# EasyEDA schematic 1-Schematic_SuperCharger_v1.json
TITLE: Sheet_1; REV: 1.0; Date: 2020-12-08; Sheet: 1/1; Drawn By: Josselin Somerville Roberts; Company: Your Company
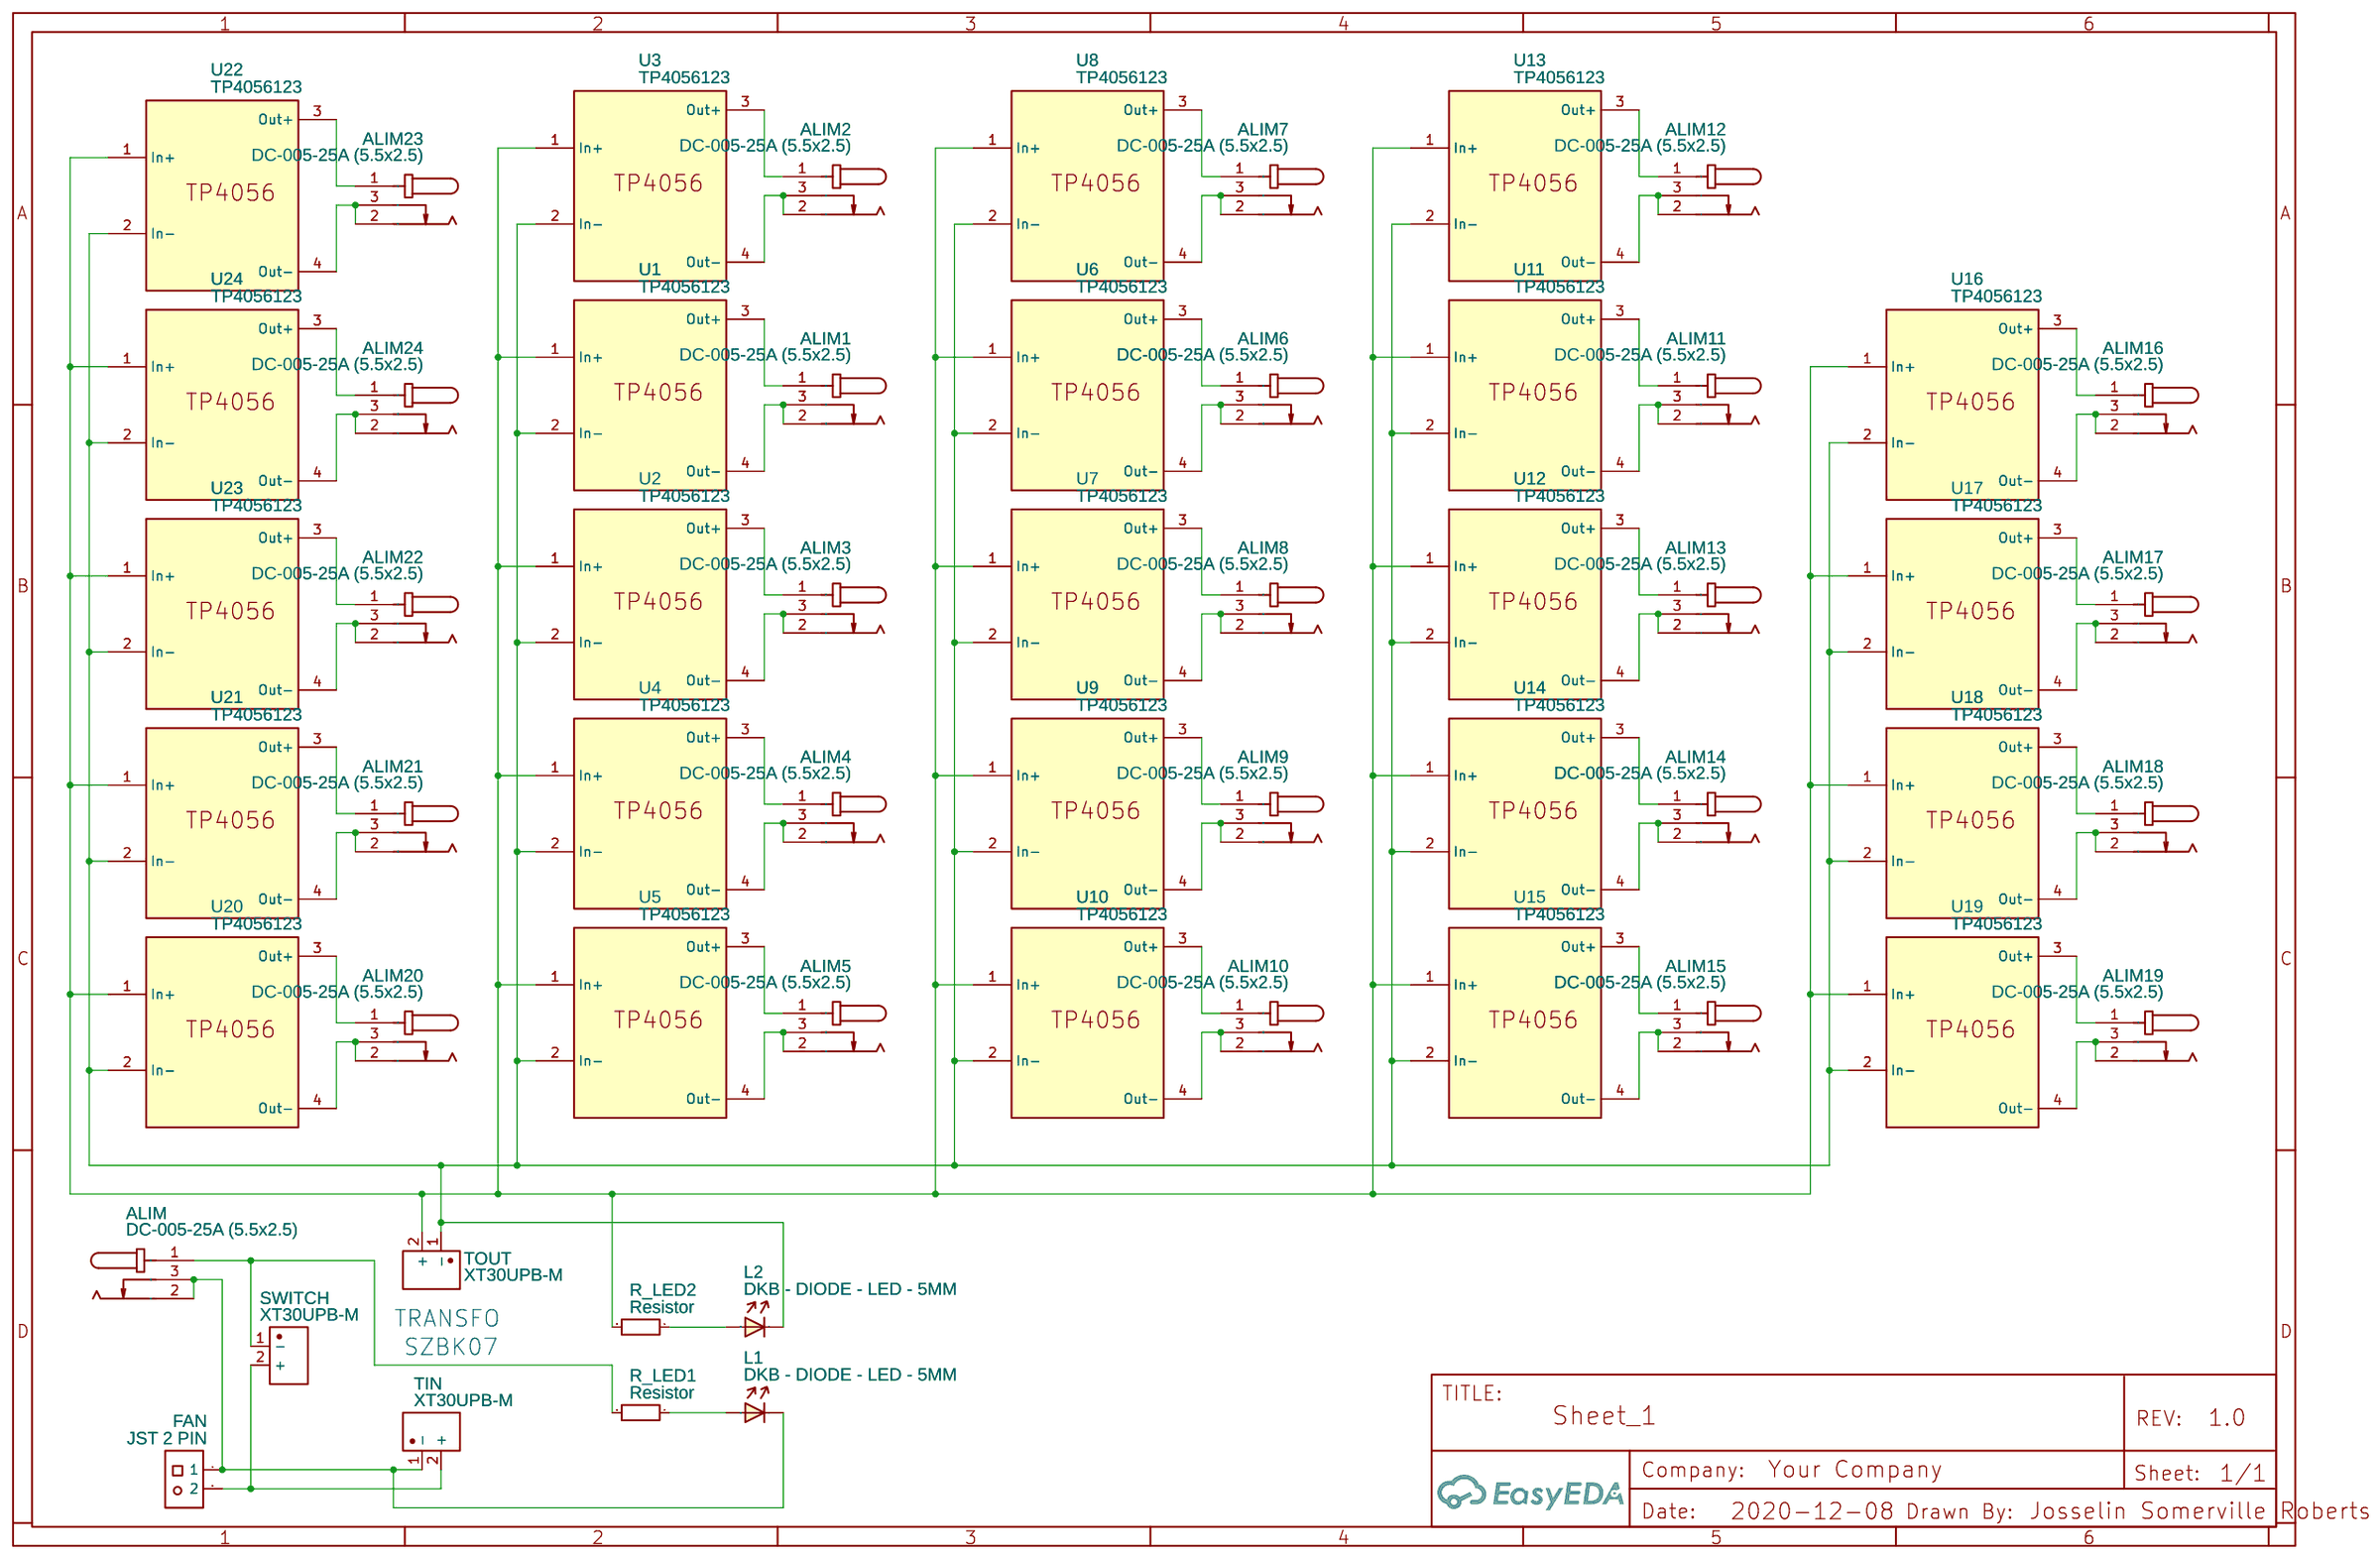
[diagram p0: schematic sheet]

## Parts
ALIM  DC-005-25A (5.5x2.5)  [DC-005-25A]
ALIM1  DC-005-25A (5.5x2.5)  [DC-005-25A]
ALIM2  DC-005-25A (5.5x2.5)  [DC-005-25A]
ALIM3  DC-005-25A (5.5x2.5)  [DC-005-25A]
ALIM4  DC-005-25A (5.5x2.5)  [DC-005-25A]
ALIM5  DC-005-25A (5.5x2.5)  [DC-005-25A]
ALIM6  DC-005-25A (5.5x2.5)  [DC-005-25A]
ALIM7  DC-005-25A (5.5x2.5)  [DC-005-25A]
ALIM8  DC-005-25A (5.5x2.5)  [DC-005-25A]
ALIM9  DC-005-25A (5.5x2.5)  [DC-005-25A]
ALIM10  DC-005-25A (5.5x2.5)  [DC-005-25A]
ALIM11  DC-005-25A (5.5x2.5)  [DC-005-25A]
ALIM12  DC-005-25A (5.5x2.5)  [DC-005-25A]
ALIM13  DC-005-25A (5.5x2.5)  [DC-005-25A]
ALIM14  DC-005-25A (5.5x2.5)  [DC-005-25A]
ALIM15  DC-005-25A (5.5x2.5)  [DC-005-25A]
ALIM16  DC-005-25A (5.5x2.5)  [DC-005-25A]
ALIM17  DC-005-25A (5.5x2.5)  [DC-005-25A]
ALIM18  DC-005-25A (5.5x2.5)  [DC-005-25A]
ALIM19  DC-005-25A (5.5x2.5)  [DC-005-25A]
ALIM20  DC-005-25A (5.5x2.5)  [DC-005-25A]
ALIM21  DC-005-25A (5.5x2.5)  [DC-005-25A]
ALIM22  DC-005-25A (5.5x2.5)  [DC-005-25A]
ALIM23  DC-005-25A (5.5x2.5)  [DC-005-25A]
ALIM24  DC-005-25A (5.5x2.5)  [DC-005-25A]
FAN  JST 2 PIN  [JST_2-PIN_2.54MM]
L1  DKB - DIODE - LED - 5MM  [5MM LED]
L2  DKB - DIODE - LED - 5MM  [5MM LED]
R_LED1  Resistor  [RESISTOR]
R_LED2  Resistor  [RESISTOR]
SWITCH  XT30UPB-M  [CONN-TH_XT30UPB-M]
TIN  XT30UPB-M  [CONN-TH_XT30UPB-M]
TOUT  XT30UPB-M  [CONN-TH_XT30UPB-M]
U1  TP4056123  [TP4056SAM]
U2  TP4056123  [TP4056SAM]
U3  TP4056123  [TP4056SAM]
U4  TP4056123  [TP4056SAM]
U5  TP4056123  [TP4056SAM]
U6  TP4056123  [TP4056SAM]
U7  TP4056123  [TP4056SAM]
U8  TP4056123  [TP4056SAM]
U9  TP4056123  [TP4056SAM]
U10  TP4056123  [TP4056SAM]
U11  TP4056123  [TP4056SAM]
U12  TP4056123  [TP4056SAM]
U13  TP4056123  [TP4056SAM]
U14  TP4056123  [TP4056SAM]
U15  TP4056123  [TP4056SAM]
U16  TP4056123  [TP4056SAM]
U17  TP4056123  [TP4056SAM]
U18  TP4056123  [TP4056SAM]
U19  TP4056123  [TP4056SAM]
U20  TP4056123  [TP4056SAM]
U21  TP4056123  [TP4056SAM]
U22  TP4056123  [TP4056SAM]
U23  TP4056123  [TP4056SAM]
U24  TP4056123  [TP4056SAM]

## Library data of the parts
ALIM ALIM1-ALIM24 = DC-005-25A (5.5x2.5): Supplier: LCSC; Manufacturer: HRO; Contributor: LCSC; Supplier Part: C136715
FAN = JST 2 PIN: Manufacturer Part: JST_XH CONNECTOR; link: https://nl.aliexpress.com/item/50-sets-Kit-in-doos-2-p-3-p-4-pin-2-54mm-Pitch-Terminal-Behuizing/32681086028.html?spm=a2g0s.9042311.0.0.I0g15Z; Contributor: CowboyWillT
L1 L2 = DKB - DIODE - LED - 5MM: Manufacturer Part: 5mm LED; Contributor: Axbri
R_LED1 R_LED2 = Resistor: Contributor: ChaseWyattt
SWITCH TIN TOUT = XT30UPB-M: Supplier: LCSC; Supplier Part: C428721; Manufacturer: Changzhou Amass Elec; Contributor: LCSC
U1-U24 = TP4056123: Contributor: Василий Пупкин

## Nets
Net-(ALIM1-1): ALIM1.1 U1.3(Out+)
Net-(ALIM1-2): ALIM1.2 ALIM1.3 U1.4(Out-)
Net-(ALIM2-1): ALIM2.1 U3.3(Out+)
Net-(ALIM2-2): ALIM2.2 ALIM2.3 U3.4(Out-)
Net-(ALIM3-1): ALIM3.1 U2.3(Out+)
Net-(ALIM3-2): ALIM3.2 ALIM3.3 U2.4(Out-)
Net-(ALIM4-1): ALIM4.1 U4.3(Out+)
Net-(ALIM4-2): ALIM4.2 ALIM4.3 U4.4(Out-)
Net-(ALIM5-1): ALIM5.1 U5.3(Out+)
Net-(ALIM5-2): ALIM5.2 ALIM5.3 U5.4(Out-)
Net-(ALIM6-1): ALIM6.1 U6.3(Out+)
Net-(ALIM6-2): ALIM6.2 ALIM6.3 U6.4(Out-)
Net-(ALIM7-1): ALIM7.1 U8.3(Out+)
Net-(ALIM7-2): ALIM7.2 ALIM7.3 U8.4(Out-)
Net-(ALIM8-1): ALIM8.1 U7.3(Out+)
Net-(ALIM8-2): ALIM8.2 ALIM8.3 U7.4(Out-)
Net-(ALIM9-1): ALIM9.1 U9.3(Out+)
Net-(ALIM9-2): ALIM9.2 ALIM9.3 U9.4(Out-)
Net-(ALIM10-1): ALIM10.1 U10.3(Out+)
Net-(ALIM10-2): ALIM10.2 ALIM10.3 U10.4(Out-)
Net-(ALIM11-1): ALIM11.1 U11.3(Out+)
Net-(ALIM11-2): ALIM11.2 ALIM11.3 U11.4(Out-)
Net-(ALIM12-1): ALIM12.1 U13.3(Out+)
Net-(ALIM12-2): ALIM12.2 ALIM12.3 U13.4(Out-)
Net-(ALIM13-1): ALIM13.1 U12.3(Out+)
Net-(ALIM13-2): ALIM13.2 ALIM13.3 U12.4(Out-)
Net-(ALIM14-1): ALIM14.1 U14.3(Out+)
Net-(ALIM14-2): ALIM14.2 ALIM14.3 U14.4(Out-)
Net-(ALIM15-1): ALIM15.1 U15.3(Out+)
Net-(ALIM15-2): ALIM15.2 ALIM15.3 U15.4(Out-)
Net-(ALIM16-1): ALIM16.1 U16.3(Out+)
Net-(ALIM16-2): ALIM16.2 ALIM16.3 U16.4(Out-)
Net-(ALIM17-1): ALIM17.1 U17.3(Out+)
Net-(ALIM17-2): ALIM17.2 ALIM17.3 U17.4(Out-)
Net-(ALIM18-1): ALIM18.1 U18.3(Out+)
Net-(ALIM18-2): ALIM18.2 ALIM18.3 U18.4(Out-)
Net-(ALIM19-1): ALIM19.1 U19.3(Out+)
Net-(ALIM19-2): ALIM19.2 ALIM19.3 U19.4(Out-)
Net-(ALIM20-1): ALIM20.1 U20.3(Out+)
Net-(ALIM20-2): ALIM20.2 ALIM20.3 U20.4(Out-)
Net-(ALIM21-1): ALIM21.1 U21.3(Out+)
Net-(ALIM21-2): ALIM21.2 ALIM21.3 U21.4(Out-)
Net-(ALIM22-1): ALIM22.1 U23.3(Out+)
Net-(ALIM22-2): ALIM22.2 ALIM22.3 U23.4(Out-)
Net-(ALIM23-1): ALIM23.1 U22.3(Out+)
Net-(ALIM23-2): ALIM23.2 ALIM23.3 U22.4(Out-)
Net-(ALIM24-1): ALIM24.1 U24.3(Out+)
Net-(ALIM24-2): ALIM24.2 ALIM24.3 U24.4(Out-)
Net-(ALIM-1): ALIM.1 R_LED1.2 SWITCH.1(-)
Net-(ALIM-2): ALIM.2 ALIM.3 FAN.1 L1.2 TIN.1(-)
Net-(FAN-2): FAN.2 SWITCH.2(+) TIN.2(+)
Net-(L1-1): L1.1 R_LED1.1
Net-(L2-1): L2.1 R_LED2.1
Net-(L2-2): L2.2 TOUT.1(-) U1.2(In-) U2.2(In-) U3.2(In-) U4.2(In-) U5.2(In-) U6.2(In-) U7.2(In-) U8.2(In-) U9.2(In-) U10.2(In-) U11.2(In-) U12.2(In-) U13.2(In-) U14.2(In-) U15.2(In-) U16.2(In-) U17.2(In-) U18.2(In-) U19.2(In-) U20.2(In-) U21.2(In-) U22.2(In-) U23.2(In-) U24.2(In-)
Net-(R_LED2-2): R_LED2.2 TOUT.2(+) U1.1(In+) U2.1(In+) U3.1(In+) U4.1(In+) U5.1(In+) U6.1(In+) U7.1(In+) U8.1(In+) U9.1(In+) U10.1(In+) U11.1(In+) U12.1(In+) U13.1(In+) U14.1(In+) U15.1(In+) U16.1(In+) U17.1(In+) U18.1(In+) U19.1(In+) U20.1(In+) U21.1(In+) U22.1(In+) U23.1(In+) U24.1(In+)

## Notes on the sheet
- TRANSFO
- SZBK07
